# Altium schematic sheet 4.SchDoc
size A0
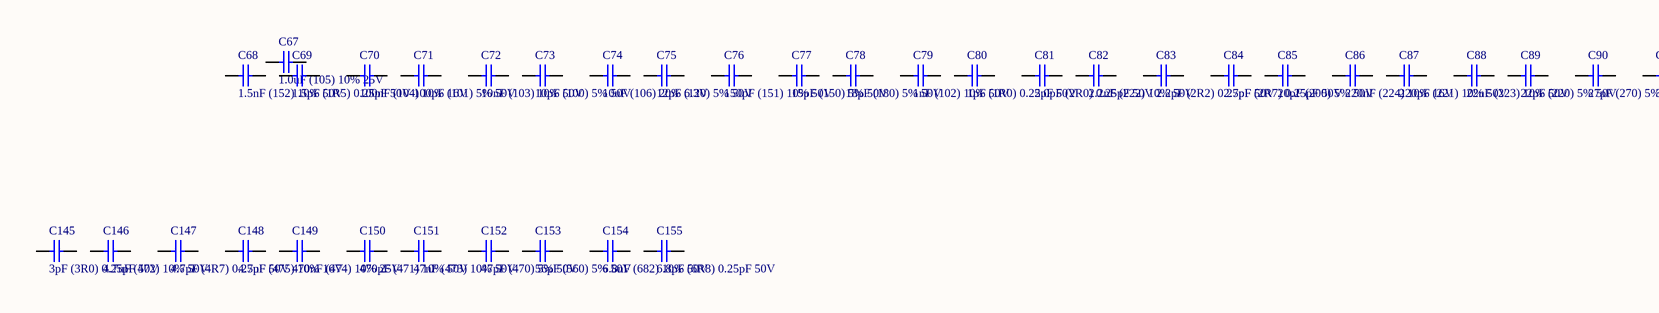
[diagram p0: 4.SchDoc, left]
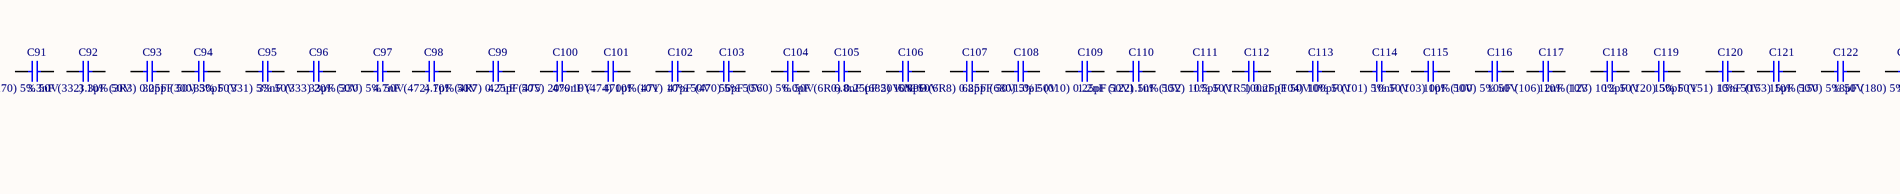
[diagram p1: 4.SchDoc, middle]
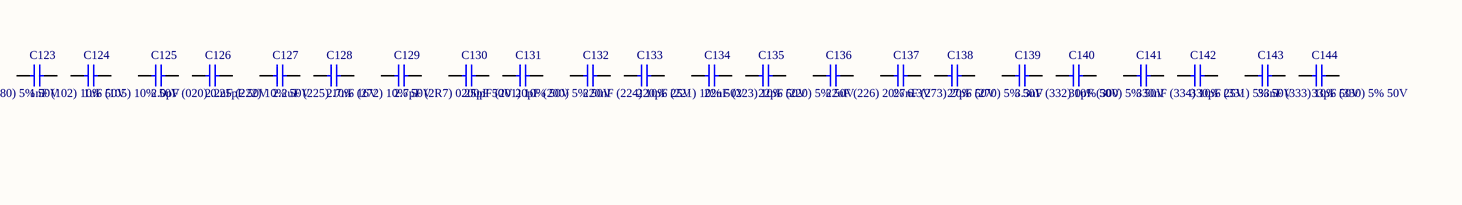
[diagram p2: 4.SchDoc, right]

## Parts
C67  1.0uF (105) 10% 25V  [LC-0402_C]
C68  1.5nF (152) 10% 50V  [LC-0402_C]
C69  1.5pF (1R5) 0.25pF 50V  [LC-0402_C]
C70  100nF (104) 10% 16V  [LC-0402_C]
C71  100pF (101) 5% 50V  [LC-0402_C]
C72  10nF (103) 10% 50V  [LC-0402_C]
C73  10pF (100) 5% 50V  [LC-0402_C]
C74  10uF (106) 20% 6.3V  [LC-0402_C]
C75  12pF (120) 5% 50V  [LC-0402_C]
C76  150pF (151) 10% 50V  [LC-0402_C]
C77  15pF (150) 5% 50V  [LC-0402_C]
C78  18pF (180) 5% 50V  [LC-0402_C]
C79  1nF (102) 10% 50V  [LC-0402_C]
C80  1pF (1R0) 0.25pF 50V  [LC-0402_C]
C81  2.0pF (2R0) 0.25pF 50V  [LC-0402_C]
C82  2.2nF (222) 10% 50V  [LC-0402_C]
C83  2.2pF (2R2) 0.25pF 50V  [LC-0402_C]
C84  2.7pF (2R7) 0.25pF 50V  [LC-0402_C]
C85  20pF (200) 5% 50V  [LC-0402_C]
C86  220nF (224) 10% 16V  [LC-0402_C]
C87  220pF (221) 10% 50V  [LC-0402_C]
C88  22nF (223) 10% 50V  [LC-0402_C]
C89  22pF (220) 5% 50V  [LC-0402_C]
C90  27pF (270) 5% 50V  [LC-0402_C]
C91  3.3nF (332) 10% 50V  [LC-0402_C]
C92  3.3pF (3R3) 0.25pF 50V  [LC-0402_C]
C93  30pF (300) 5% 50V  [LC-0402_C]
C94  330pF (331) 5% 50V  [LC-0402_C]
C95  33nF (333) 20% 50V  [LC-0402_C]
C96  33pF (330) 5% 50V  [LC-0402_C]
C97  4.7nF (472) 10% 50V  [LC-0402_C]
C98  4.7pF (4R7) 0.25pF 50V  [LC-0402_C]
C99  4.7uF (475) 20% 10V  [LC-0402_C]
C100  470nF (474) 10% 10V  [LC-0402_C]
C101  470pF (471) 10% 50V  [LC-0402_C]
C102  47pF (470) 5% 50V  [LC-0402_C]
C103  56pF (560) 5% 50V  [LC-0402_C]
C104  6.0pF (6R0) 0.25pF 50V NPO  [LC-0402_C]
C105  6.8nF (682) 10% 50V  [LC-0402_C]
C106  6.8pF (6R8) 0.25pF 50V  [LC-0402_C]
C107  68pF (680) 5% 50V  [LC-0402_C]
C108  1.0pF (010) 0.25pF 50V  [LC-0603_C]
C109  1.2nF (122) 10% 50V  [LC-0603_C]
C110  1.5nF (152) 10% 50V  [LC-0603_C]
C111  1.5pF (1R5) 0.25pF 50V  [LC-0603_C]
C112  100nF (104) 10% 50V  [LC-0603_C]
C113  100pF (101) 5% 50V  [LC-0603_C]
C114  10nF (103) 10% 50V  [LC-0603_C]
C115  10pF (100) 5% 50V  [LC-0603_C]
C116  10uF (106) 10% 10V  [LC-0603_C]
C117  12nF (123) 10% 50V  [LC-0603_C]
C118  12pF (120) 5% 50V  [LC-0603_C]
C119  150pF (151) 10% 50V  [LC-0603_C]
C120  15nF (153) 10% 50V  [LC-0603_C]
C121  15pF (150) 5% 50V  [LC-0603_C]
C122  18pF (180) 5% 50V  [LC-0603_C]
C123  1nF (102) 10% 50V  [LC-0603_C]
C124  1uF (105) 10% 50V  [LC-0603_C]
C125  2.0pF (020) 0.25pF 50V  [LC-0603_C]
C126  2.2nF (222) 10% 50V  [LC-0603_C]
C127  2.2uF (225) 10% 16V  [LC-0603_C]
C128  2.7nF (272) 10% 50V  [LC-0603_C]
C129  2.7pF (2R7) 0.25pF 50V  [LC-0603_C]
C130  200pF (201) 10% 50V  [LC-0603_C]
C131  20pF (200) 5% 50V  [LC-0603_C]
C132  220nF (224) 10% 25V  [LC-0603_C]
C133  220pF (221) 10% 50V  [LC-0603_C]
C134  22nF (223) 10% 50V  [LC-0603_C]
C135  22pF (220) 5% 50V  [LC-0603_C]
C136  22uF (226) 20% 6.3V  [LC-0603_C]
C137  27nF (273) 20% 50V  [LC-0603_C]
C138  27pF (270) 5% 50V  [LC-0603_C]
C139  3.3nF (332) 10% 50V  [LC-0603_C]
C140  30pF (300) 5% 50V  [LC-0603_C]
C141  330nF (334) 10% 25V  [LC-0603_C]
C142  330pF (331) 5% 50V  [LC-0603_C]
C143  33nF (333) 10% 50V  [LC-0603_C]
C144  33pF (330) 5% 50V  [LC-0603_C]
C145  3pF (3R0) 0.25pF 50V  [LC-0603_C]
C146  4.7nF (472) 10% 50V  [LC-0603_C]
C147  4.7pF (4R7) 0.25pF 50V  [LC-0603_C]
C148  4.7uF (475) 10% 16V  [LC-0603_C]
C149  470nF (474) 10% 25V  [LC-0603_C]
C150  470pF (471) 10% 50V  [LC-0603_C]
C151  47nF (473) 10% 50V  [LC-0603_C]
C152  47pF (470) 5% 50V  [LC-0603_C]
C153  56pF (560) 5% 50V  [LC-0603_C]
C154  6.8nF (682) 10% 50V  [LC-0603_C]
C155  6.8pF (6R8) 0.25pF 50V  [LC-0603_C]

## Nets

Not connected (* = marked no-connect by the designer): C67 1 2; C68 1 2; C69 1 2; C70 1 2; C71 1 2; C72 1 2; C73 1 2; C74 1 2; C75 1 2; C76 1 2; C77 1 2; C78 1 2; C79 1 2; C80 1 2; C81 1 2; C82 1 2; C83 1 2; C84 1 2; C85 1 2; C86 1 2; C87 1 2; C88 1 2; C89 1 2; C90 1 2; C91 1 2; C92 1 2; C93 1 2; C94 1 2; C95 1 2; C96 1 2; C97 1 2; C98 1 2; C99 1 2; C100 1 2; C101 1 2; C102 1 2; C103 1 2; C104 1 2; C105 1 2; C106 1 2; C107 1 2; C108 1 2; C109 1 2; C110 1 2; C111 1 2; C112 1 2; C113 1 2; C114 1 2; C115 1 2; C116 1 2; C117 1 2; C118 1 2; C119 1 2; C120 1 2; C121 1 2; C122 1 2; C123 1 2; C124 1 2; C125 1 2; C126 1 2; C127 1 2; C128 1 2; C129 1 2; C130 1 2; C131 1 2; C132 1 2; C133 1 2; C134 1 2; C135 1 2; C136 1 2; C137 1 2; C138 1 2; C139 1 2; C140 1 2; C141 1 2; C142 1 2; C143 1 2; C144 1 2; C145 1 2; C146 1 2; C147 1 2; C148 1 2; C149 1 2; C150 1 2; C151 1 2; C152 1 2; C153 1 2; C154 1 2; C155 1 2

## Library data of the parts
C67 = 0402 1.0uF (105) 10% 25V: 贴片电容; ComponentLink1Description: 供应商链接; ComponentLink1URL: http://www.szlcsc.com/product/details_53938.html; Package: 0402; Supplier: LC; SuppliersPartNumber: C52923
C68 = 0402 1.5nF (152) 10% 50V: 贴片电容; ComponentLink1Description: 供应商链接; ComponentLink1URL: http://www.szlcsc.com/product/details_24707.html; Package: 0402; Supplier: LC; SuppliersPartNumber: C23967
C69 = 0402 1.5pF (1R5) 0.25pF 50V: 贴片电容; ComponentLink1Description: 供应商链接; ComponentLink1URL: http://www.szlcsc.com/product/details_1904.html; Package: 0402; Supplier: LC; SuppliersPartNumber: C1552
C70 = 0402 100nF (104) 10% 16V: 贴片电容; ComponentLink1Description: 供应商链接; ComponentLink1URL: http://www.szlcsc.com/product/details_1877.html; Package: 0402; Supplier: LC; SuppliersPartNumber: C1525
C71 = 0402 100pF (101) 5% 50V: 贴片电容; ComponentLink1Description: 供应商链接; ComponentLink1URL: http://www.szlcsc.com/product/details_1898.html; Package: 0402; Supplier: LC; SuppliersPartNumber: C1546
C72 = 0402 10nF (103) 10% 50V: 贴片电容; ComponentLink1Description: 供应商链接; ComponentLink1URL: http://www.szlcsc.com/product/details_15869.html; Package: 0402; Supplier: LC; SuppliersPartNumber: C15195
C73 = 0402 10pF (100) 5% 50V: 贴片电容; ComponentLink1Description: 供应商链接; ComponentLink1URL: http://www.szlcsc.com/product/details_33914.html; Package: 0402; Supplier: LC; SuppliersPartNumber: C32949
C74 = 0402 10uF (106) 20% 6.3V: 贴片电容; ComponentLink1Description: 供应商链接; ComponentLink1URL: http://www.szlcsc.com/product/details_16204.html; Package: 0402; Supplier: LC; SuppliersPartNumber: C15525
C75 = 0402 12pF (120) 5% 50V: 贴片电容; ComponentLink1Description: 供应商链接; ComponentLink1URL: http://www.szlcsc.com/product/details_1899.html; Package: 0402; Supplier: LC; SuppliersPartNumber: C1547
C76 = 0402 150pF (151) 10% 50V: 贴片电容; ComponentLink1Description: 供应商链接; ComponentLink1URL: http://www.szlcsc.com/product/details_1879.html; Package: 0402; Supplier: LC; SuppliersPartNumber: C1527
C77 = 0402 15pF (150) 5% 50V: 贴片电容; ComponentLink1Description: 供应商链接; ComponentLink1URL: http://www.szlcsc.com/product/details_1900.html; Package: 0402; Supplier: LC; SuppliersPartNumber: C1548
C78 = 0402 18pF (180) 5% 50V: 贴片电容; ComponentLink1Description: 供应商链接; ComponentLink1URL: http://www.szlcsc.com/product/details_1901.html; Package: 0402; Supplier: LC; SuppliersPartNumber: C1549
C79 = 0402 1nF (102) 10% 50V: 贴片电容; ComponentLink1Description: 供应商链接; ComponentLink1URL: http://www.szlcsc.com/product/details_1875.html; Package: 0402; Supplier: LC; SuppliersPartNumber: C1523
C80 = 0402 1pF (1R0) 0.25pF 50V: 贴片电容; ComponentLink1Description: 供应商链接; ComponentLink1URL: http://www.szlcsc.com/product/details_1902.html; Package: 0402; Supplier: LC; SuppliersPartNumber: C1550
C81 = 0402 2.0pF (2R0) 0.25pF 50V: 贴片电容; ComponentLink1Description: 供应商链接; ComponentLink1URL: http://www.szlcsc.com/product/details_1910.html; Package: 0402; Supplier: LC; SuppliersPartNumber: C1558
C82 = 0402 2.2nF (222) 10% 50V: 贴片电容; ComponentLink1Description: 供应商链接; ComponentLink1URL: http://www.szlcsc.com/product/details_1883.html; Package: 0402; Supplier: LC; SuppliersPartNumber: C1531
C83 = 0402 2.2pF (2R2) 0.25pF 50V: 贴片电容; ComponentLink1Description: 供应商链接; ComponentLink1URL: http://www.szlcsc.com/product/details_1911.html; Package: 0402; Supplier: LC; SuppliersPartNumber: C1559
C84 = 0402 2.7pF (2R7) 0.25pF 50V: 贴片电容; ComponentLink1Description: 供应商链接; ComponentLink1URL: http://www.szlcsc.com/product/details_1913.html; Package: 0402; Supplier: LC; SuppliersPartNumber: C1561
C85 = 0402 20pF (200) 5% 50V: 贴片电容; ComponentLink1Description: 供应商链接; ComponentLink1URL: http://www.szlcsc.com/product/details_1906.html; Package: 0402; Supplier: LC; SuppliersPartNumber: C1554
C86 = 0402 220nF (224) 10% 16V: 贴片电容; ComponentLink1Description: 供应商链接; ComponentLink1URL: http://www.szlcsc.com/product/details_17456.html; Package: 0402; Supplier: LC; SuppliersPartNumber: C16772
C87 = 0402 220pF (221) 10% 50V: 贴片电容; ComponentLink1Description: 供应商链接; ComponentLink1URL: http://www.szlcsc.com/product/details_1882.html; Package: 0402; Supplier: LC; SuppliersPartNumber: C1530
C88 = 0402 22nF (223) 10% 50V: 贴片电容; ComponentLink1Description: 供应商链接; ComponentLink1URL: http://www.szlcsc.com/product/details_1884.html; Package: 0402; Supplier: LC; SuppliersPartNumber: C1532
C89 = 0402 22pF (220) 5% 50V: 贴片电容; ComponentLink1Description: 供应商链接; ComponentLink1URL: http://www.szlcsc.com/product/details_1907.html; Package: 0402; Supplier: LC; SuppliersPartNumber: C1555
C90 = 0402 27pF (270) 5% 50V: 贴片电容; ComponentLink1Description: 供应商链接; ComponentLink1URL: http://www.szlcsc.com/product/details_1909.html; Package: 0402; Supplier: LC; SuppliersPartNumber: C1557
C91 = 0402 3.3nF (332) 10% 50V: 贴片电容; ComponentLink1Description: 供应商链接; ComponentLink1URL: http://www.szlcsc.com/product/details_27148.html; Package: 0402; Supplier: LC; SuppliersPartNumber: C26404
C92 = 0402 3.3pF (3R3) 0.25pF 50V: 贴片电容; ComponentLink1Description: 供应商链接; ComponentLink1URL: http://www.szlcsc.com/product/details_1917.html; Package: 0402; Supplier: LC; SuppliersPartNumber: C1565
C93 = 0402 30pF (300) 5% 50V: 贴片电容; ComponentLink1Description: 供应商链接; ComponentLink1URL: http://www.szlcsc.com/product/details_1922.html; Package: 0402; Supplier: LC; SuppliersPartNumber: C1570
C94 = 0402 330pF (331) 5% 50V: 贴片电容; ComponentLink1Description: 供应商链接; ComponentLink1URL: http://www.szlcsc.com/product/details_14182.html; Package: 0402; Supplier: LC; SuppliersPartNumber: C13533
C95 = 0402 33nF (333) 20% 50V: 贴片电容; ComponentLink1Description: 供应商链接; ComponentLink1URL: http://www.szlcsc.com/product/details_1937.html; Package: 0402; Supplier: LC; SuppliersPartNumber: C1585
C96 = 0402 33pF (330) 5% 50V: 贴片电容; ComponentLink1Description: 供应商链接; ComponentLink1URL: http://www.szlcsc.com/product/details_1914.html; Package: 0402; Supplier: LC; SuppliersPartNumber: C1562
C97 = 0402 4.7nF (472) 10% 50V: 贴片电容; ComponentLink1Description: 供应商链接; ComponentLink1URL: http://www.szlcsc.com/product/details_1890.html; Package: 0402; Supplier: LC; SuppliersPartNumber: C1538
C98 = 0402 4.7pF (4R7) 0.25pF 50V: 贴片电容; ComponentLink1Description: 供应商链接; ComponentLink1URL: http://www.szlcsc.com/product/details_1921.html; Package: 0402; Supplier: LC; SuppliersPartNumber: C1569
C99 = 0402 4.7uF (475) 20% 10V: 贴片电容; ComponentLink1Description: 供应商链接; ComponentLink1URL: http://www.szlcsc.com/product/details_24469.html; Package: 0402; Supplier: LC; SuppliersPartNumber: C23733
C100 = 0402 470nF (474) 10% 10V: 贴片电容; ComponentLink1Description: 供应商链接; ComponentLink1URL: http://www.szlcsc.com/product/details_48344.html; Package: 0402; Supplier: LC; SuppliersPartNumber: C47339
C101 = 0402 470pF (471) 10% 50V: 贴片电容; ComponentLink1Description: 供应商链接; ComponentLink1URL: http://www.szlcsc.com/product/details_1889.html; Package: 0402; Supplier: LC; SuppliersPartNumber: C1537
C102 = 0402 47pF (470) 5% 50V: 贴片电容; ComponentLink1Description: 供应商链接; ComponentLink1URL: http://www.szlcsc.com/product/details_1919.html; Package: 0402; Supplier: LC; SuppliersPartNumber: C1567
C103 = 0402 56pF (560) 5% 50V: 贴片电容; ComponentLink1Description: 供应商链接; ComponentLink1URL: http://www.szlcsc.com/product/details_1924.html; Package: 0402; Supplier: LC; SuppliersPartNumber: C1572
C104 = 0402 6.0pF (6R0) 0.25pF 50V NPO: 贴片电容; ComponentLink1Description: 供应商链接; ComponentLink1URL: http://www.szlcsc.com/product/details_31031.html; Package: 0402; Supplier: LC; SuppliersPartNumber: C30274
C105 = 0402 6.8nF (682) 10% 50V: 贴片电容; ComponentLink1Description: 供应商链接; ComponentLink1URL: http://www.szlcsc.com/product/details_1894.html; Package: 0402; Supplier: LC; SuppliersPartNumber: C1542
C106 = 0402 6.8pF (6R8) 0.25pF 50V: 贴片电容; ComponentLink1Description: 供应商链接; ComponentLink1URL: http://www.szlcsc.com/product/details_1928.html; Package: 0402; Supplier: LC; SuppliersPartNumber: C1576
C107 = 0402 68pF (680) 5% 50V: 贴片电容; ComponentLink1Description: 供应商链接; ComponentLink1URL: http://www.szlcsc.com/product/details_15103.html; Package: 0402; Supplier: LC; SuppliersPartNumber: C14441
C108 = 0603 1.0pF (010) 0.25pF 50V: 贴片电容; ComponentLink1Description: 供应商链接; ComponentLink1URL: http://www.szlcsc.com/product/details_24709.html; Package: 0603; Supplier: LC; SuppliersPartNumber: C23969
C109 = 0603 1.2nF (122) 10% 50V: 贴片电容; ComponentLink1Description: 供应商链接; ComponentLink1URL: http://www.szlcsc.com/product/details_31372.html; Package: 0603; Supplier: LC; SuppliersPartNumber: C30615
C110 = 0603 1.5nF (152) 10% 50V: 贴片电容; ComponentLink1Description: 供应商链接; ComponentLink1URL: http://www.szlcsc.com/product/details_1947.html; Package: 0603; Supplier: LC; SuppliersPartNumber: C1595
C111 = 0603 1.5pF (1R5) 0.25pF 50V: 贴片电容; ComponentLink1Description: 供应商链接; ComponentLink1URL: http://www.szlcsc.com/product/details_1991.html; Package: 0603; Supplier: LC; SuppliersPartNumber: C1639
C112 = 0603 100nF (104) 10% 50V: 贴片电容; ComponentLink1Description: 供应商链接; ComponentLink1URL: http://www.szlcsc.com/product/details_15331.html; Package: 0603; Supplier: LC; SuppliersPartNumber: C14663
C113 = 0603 100pF (101) 5% 50V: 贴片电容; ComponentLink1Description: 供应商链接; ComponentLink1URL: http://www.szlcsc.com/product/details_15530.html; Package: 0603; Supplier: LC; SuppliersPartNumber: C14858
C114 = 0603 10nF (103) 10% 50V: 贴片电容; ComponentLink1Description: 供应商链接; ComponentLink1URL: http://www.szlcsc.com/product/details_58143.html; Package: 0603; Supplier: LC; SuppliersPartNumber: C57112
C115 = 0603 10pF (100) 5% 50V: 贴片电容; ComponentLink1Description: 供应商链接; ComponentLink1URL: http://www.szlcsc.com/product/details_1986.html; Package: 0603; Supplier: LC; SuppliersPartNumber: C1634
C116 = 0603 10uF (106) 10% 10V: 贴片电容; ComponentLink1Description: 供应商链接; ComponentLink1URL: http://www.szlcsc.com/product/details_20411.html; Package: 0603; Supplier: LC; SuppliersPartNumber: C19702
C117 = 0603 12nF (123) 10% 50V: 贴片电容; ComponentLink1Description: 供应商链接; ComponentLink1URL: http://www.szlcsc.com/product/details_1945.html; Package: 0603; Supplier: LC; SuppliersPartNumber: C1593
C118 = 0603 12pF (120) 5% 50V: 贴片电容; ComponentLink1Description: 供应商链接; ComponentLink1URL: http://www.szlcsc.com/product/details_39506.html; Package: 0603; Supplier: LC; SuppliersPartNumber: C38523
C119 = 0603 150pF (151) 10% 50V: 贴片电容; ComponentLink1Description: 供应商链接; ComponentLink1URL: http://www.szlcsc.com/product/details_1946.html; Package: 0603; Supplier: LC; SuppliersPartNumber: C1594
C120 = 0603 15nF (153) 10% 50V: 贴片电容; ComponentLink1Description: 供应商链接; ComponentLink1URL: http://www.szlcsc.com/product/details_1948.html; Package: 0603; Supplier: LC; SuppliersPartNumber: C1596
C121 = 0603 15pF (150) 5% 50V: 贴片电容; ComponentLink1Description: 供应商链接; ComponentLink1URL: http://www.szlcsc.com/product/details_1996.html; Package: 0603; Supplier: LC; SuppliersPartNumber: C1644
C122 = 0603 18pF (180) 5% 50V: 贴片电容; ComponentLink1Description: 供应商链接; ComponentLink1URL: http://www.szlcsc.com/product/details_1999.html; Package: 0603; Supplier: LC; SuppliersPartNumber: C1647
C123 = 0603 1nF (102) 10% 50V: 贴片电容; ComponentLink1Description: 供应商链接; ComponentLink1URL: http://www.szlcsc.com/product/details_1940.html; Package: 0603; Supplier: LC; SuppliersPartNumber: C1588
C124 = 0603 1uF (105) 10% 50V: 贴片电容; ComponentLink1Description: 供应商链接; ComponentLink1URL: http://www.szlcsc.com/product/details_16531.html; Package: 0603; Supplier: LC; SuppliersPartNumber: C15849
C125 = 0603 2.0pF (020) 0.25pF 50V: 贴片电容; ComponentLink1Description: 供应商链接; ComponentLink1URL: http://www.szlcsc.com/product/details_22617.html; Package: 0603; Supplier: LC; SuppliersPartNumber: C21895
C126 = 0603 2.2nF (222) 10% 50V: 贴片电容; ComponentLink1Description: 供应商链接; ComponentLink1URL: http://www.szlcsc.com/product/details_1956.html; Package: 0603; Supplier: LC; SuppliersPartNumber: C1604
C127 = 0603 2.2uF (225) 10% 16V: 贴片电容; ComponentLink1Description: 供应商链接; ComponentLink1URL: http://www.szlcsc.com/product/details_24366.html; Package: 0603; Supplier: LC; SuppliersPartNumber: C23630
C128 = 0603 2.7nF (272) 10% 50V: 贴片电容; ComponentLink1Description: 供应商链接; ComponentLink1URL: http://www.szlcsc.com/product/details_1961.html; Package: 0603; Supplier: LC; SuppliersPartNumber: C1609
C129 = 0603 2.7pF (2R7) 0.25pF 50V: 贴片电容; ComponentLink1Description: 供应商链接; ComponentLink1URL: http://www.szlcsc.com/product/details_16831.html; Package: 0603; Supplier: LC; SuppliersPartNumber: C16149
C130 = 0603 200pF (201) 10% 50V: 贴片电容; ComponentLink1Description: 供应商链接; ComponentLink1URL: http://www.szlcsc.com/product/details_1952.html; Package: 0603; Supplier: LC; SuppliersPartNumber: C1600
C131 = 0603 20pF (200) 5% 50V: 贴片电容; ComponentLink1Description: 供应商链接; ComponentLink1URL: http://www.szlcsc.com/product/details_2000.html; Package: 0603; Supplier: LC; SuppliersPartNumber: C1648
C132 = 0603 220nF (224) 10% 25V: 贴片电容; ComponentLink1Description: 供应商链接; ComponentLink1URL: http://www.szlcsc.com/product/details_21832.html; Package: 0603; Supplier: LC; SuppliersPartNumber: C21120
C133 = 0603 220pF (221) 10% 50V: 贴片电容; ComponentLink1Description: 供应商链接; ComponentLink1URL: http://www.szlcsc.com/product/details_1955.html; Package: 0603; Supplier: LC; SuppliersPartNumber: C1603
C134 = 0603 22nF (223) 10% 50V: 贴片电容; ComponentLink1Description: 供应商链接; ComponentLink1URL: http://www.szlcsc.com/product/details_21834.html; Package: 0603; Supplier: LC; SuppliersPartNumber: C21122
C135 = 0603 22pF (220) 5% 50V: 贴片电容; ComponentLink1Description: 供应商链接; ComponentLink1URL: http://www.szlcsc.com/product/details_2005.html; Package: 0603; Supplier: LC; SuppliersPartNumber: C1653
C136 = 0603 22uF (226) 20% 6.3V: 贴片电容; ComponentLink1Description: 供应商链接; ComponentLink1URL: http://www.szlcsc.com/product/details_60514.html; Package: 0603; Supplier: LC; SuppliersPartNumber: C59461
C137 = 0603 27nF (273) 20% 50V: 贴片电容; ComponentLink1Description: 供应商链接; ComponentLink1URL: http://www.szlcsc.com/product/details_2052.html; Package: 0603; Supplier: LC; SuppliersPartNumber: C1700
C138 = 0603 27pF (270) 5% 50V: 贴片电容; ComponentLink1Description: 供应商链接; ComponentLink1URL: http://www.szlcsc.com/product/details_2008.html; Package: 0603; Supplier: LC; SuppliersPartNumber: C1656
C139 = 0603 3.3nF (332) 10% 50V: 贴片电容; ComponentLink1Description: 供应商链接; ComponentLink1URL: http://www.szlcsc.com/product/details_1965.html; Package: 0603; Supplier: LC; SuppliersPartNumber: C1613
C140 = 0603 30pF (300) 5% 50V: 贴片电容; ComponentLink1Description: 供应商链接; ComponentLink1URL: http://www.szlcsc.com/product/details_23122.html; Package: 0603; Supplier: LC; SuppliersPartNumber: C22397
C141 = 0603 330nF (334) 10% 25V: 贴片电容; ComponentLink1Description: 供应商链接; ComponentLink1URL: http://www.szlcsc.com/product/details_1967.html; Package: 0603; Supplier: LC; SuppliersPartNumber: C1615
C142 = 0603 330pF (331) 5% 50V: 贴片电容; ComponentLink1Description: 供应商链接; ComponentLink1URL: http://www.szlcsc.com/product/details_2016.html; Package: 0603; Supplier: LC; SuppliersPartNumber: C1664
C143 = 0603 33nF (333) 10% 50V: 贴片电容; ComponentLink1Description: 供应商链接; ComponentLink1URL: http://www.szlcsc.com/product/details_21829.html; Package: 0603; Supplier: LC; SuppliersPartNumber: C21117
C144 = 0603 33pF (330) 5% 50V: 贴片电容; ComponentLink1Description: 供应商链接; ComponentLink1URL: http://www.szlcsc.com/product/details_2015.html; Package: 0603; Supplier: LC; SuppliersPartNumber: C1663
C145 = 0603 3pF (3R0) 0.25pF 50V: 贴片电容; ComponentLink1Description: 供应商链接; ComponentLink1URL: http://www.szlcsc.com/product/details_47222.html; Package: 0603; Supplier: LC; SuppliersPartNumber: C46219
C146 = 0603 4.7nF (472) 10% 50V: 贴片电容; ComponentLink1Description: 供应商链接; ComponentLink1URL: http://www.szlcsc.com/product/details_55004.html; Package: 0603; Supplier: LC; SuppliersPartNumber: C53987
C147 = 0603 4.7pF (4R7) 0.25pF 50V: 贴片电容; ComponentLink1Description: 供应商链接; ComponentLink1URL: http://www.szlcsc.com/product/details_2021.html; Package: 0603; Supplier: LC; SuppliersPartNumber: C1669
C148 = 0603 4.7uF (475) 10% 16V: 贴片电容; ComponentLink1Description: 供应商链接; ComponentLink1URL: http://www.szlcsc.com/product/details_20375.html; Package: 0603; Supplier: LC; SuppliersPartNumber: C19666
C149 = 0603 470nF (474) 10% 25V: 贴片电容; ComponentLink1Description: 供应商链接; ComponentLink1URL: http://www.szlcsc.com/product/details_1975.html; Package: 0603; Supplier: LC; SuppliersPartNumber: C1623
C150 = 0603 470pF (471) 10% 50V: 贴片电容; ComponentLink1Description: 供应商链接; ComponentLink1URL: http://www.szlcsc.com/product/details_1972.html; Package: 0603; Supplier: LC; SuppliersPartNumber: C1620
C151 = 0603 47nF (473) 10% 50V: 贴片电容; ComponentLink1Description: 供应商链接; ComponentLink1URL: http://www.szlcsc.com/product/details_1974.html; Package: 0603; Supplier: LC; SuppliersPartNumber: C1622
C152 = 0603 47pF (470) 5% 50V: 贴片电容; ComponentLink1Description: 供应商链接; ComponentLink1URL: http://www.szlcsc.com/product/details_2023.html; Package: 0603; Supplier: LC; SuppliersPartNumber: C1671
C153 = 0603 56pF (560) 5% 50V: 贴片电容; ComponentLink1Description: 供应商链接; ComponentLink1URL: http://www.szlcsc.com/product/details_40131.html; Package: 0603; Supplier: LC; SuppliersPartNumber: C39148
C154 = 0603 6.8nF (682) 10% 50V: 贴片电容; ComponentLink1Description: 供应商链接; ComponentLink1URL: http://www.szlcsc.com/product/details_1983.html; Package: 0603; Supplier: LC; SuppliersPartNumber: C1631
C155 = 0603 6.8pF (6R8) 0.25pF 50V: 贴片电容; ComponentLink1Description: 供应商链接; ComponentLink1URL: http://www.szlcsc.com/product/details_2031.html; Package: 0603; Supplier: LC; SuppliersPartNumber: C1679